# Altium schematic sheet inverter.SchDoc
size 431 x 279 mm; SheetNumber: 4; SheetTotal: 4
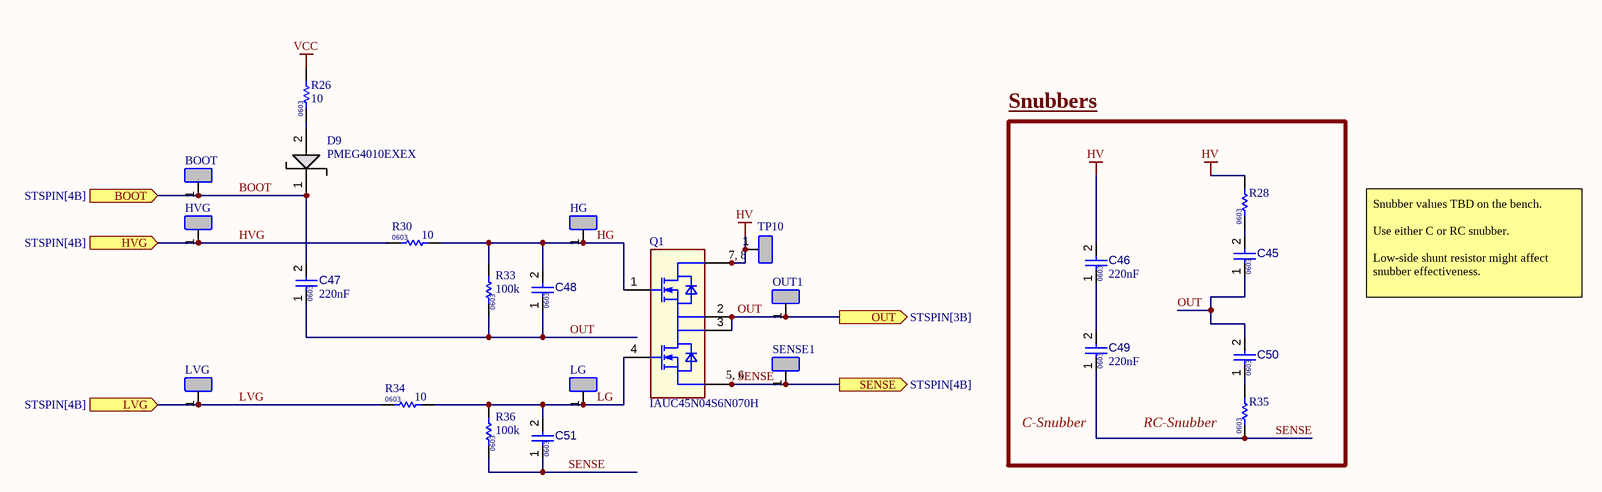
[diagram p0: inverter.SchDoc]

## Parts
BOOT  RCT-0C  [RCT-0C-Footprint-1]  (value not drawn)
C45  Ceramic Capacitor 0603 Temp  [0603 IPC Class B]  (value not drawn)
C46  value 220nF  [0603 IPC Class B]  (hidden comment: Ceramic Capacitor 0.22uF +/-10% 50V 0603)
C47  value 220nF  [0603 IPC Class B]  (hidden comment: Ceramic Capacitor 0.22uF +/-10% 50V 0603)
C48  Ceramic Capacitor 0603 Temp  [0603 IPC Class B]  (value not drawn)
C49  value 220nF  [0603 IPC Class B]  (hidden comment: Ceramic Capacitor 0.22uF +/-10% 50V 0603)
C50  Ceramic Capacitor 0603 Temp  [0603 IPC Class B]  (value not drawn)
C51  Ceramic Capacitor 0603 Temp  [0603 IPC Class B]  (value not drawn)
D9  PMEG4010EXEX  [PMEG4010EXEX]
HG  RCT-0C  [RCT-0C-Footprint-1]  (value not drawn)
HVG  RCT-0C  [RCT-0C-Footprint-1]  (value not drawn)
LG  RCT-0C  [RCT-0C-Footprint-1]  (value not drawn)
LVG  RCT-0C  [RCT-0C-Footprint-1]  (value not drawn)
OUT1  RCT-0C  [RCT-0C-Footprint-1]  (value not drawn)
Q1  IAUC45N04S6N070H  [IFX-PG-TDSON-8-57-V]
R26  value 10  [0603 IPC Class B]  (hidden comment: Resistor 10R +/-1% 250mW 0603)
R28  Resistor 0603 Temp  [0603 IPC Class B]  (value not drawn)
R30  value 10  [0603 IPC Class B]  (hidden comment: Resistor 10R +/-1% 250mW 0603)
R33  value 100k  [0603 IPC Class B]  (hidden comment: Resistor 100k +/-1% 1/10W 0603)
R34  value 10  [0603 IPC Class B]  (hidden comment: Resistor 10R +/-1% 250mW 0603)
R35  Resistor 0603 Temp  [0603 IPC Class B]  (value not drawn)
R36  value 100k  [0603 IPC Class B]  (hidden comment: Resistor 100k +/-1% 1/10W 0603)
SENSE1  RCT-0C  [RCT-0C-Footprint-1]  (value not drawn)
TP10  RCT-0C  [RCT-0C-Footprint-1]  (value not drawn)

## Blocks framed on the sheet
Snubbers: C45 C46 C49 C50 R28 R35

## Ports
BOOT (in, see STSPIN[4B]), HVG (in, see STSPIN[4B]), LVG (in, see STSPIN[4B]), OUT (out, see STSPIN[3B]), SENSE (out, see STSPIN[4B])

## Nets
HV: C46.2 Q1.7(DRAIN1_1) Q1.8(DRAIN1_2) R28.2 TP10.1(SIGNAL)
VCC: R26.2
BOOT: BOOT.1(SIGNAL) C47.2 D9.1(K) ; port BOOT
HG: C48.2 HG.1(SIGNAL) Q1.1(GATE1) R30.2 R33.2
HVG: HVG.1(SIGNAL) R30.1 ; port HVG
LG: C51.2 LG.1(SIGNAL) Q1.4(GATE2) R34.2 R36.2
LVG: LVG.1(SIGNAL) R34.1 ; port LVG
OUT: C45.1 C47.1 C48.1 C50.2 OUT1.1(SIGNAL) Q1.2(SOURCE1) Q1.3(DRAIN2) R33.1 ; port OUT
SENSE: C49.1 C51.1 Q1.5(SOURCE2_1) Q1.6(SOURCE2_2) R35.1 R36.1 SENSE1.1(SIGNAL) ; port SENSE
NetC45_2: C45.2 R28.1
NetC46_1: C46.1 C49.2
NetC50_1: C50.1 R35.2
NetD9_2: D9.2(A) R26.1

## Notes on the sheet
- Snubber values TBD on the bench.
  Use either C or RC snubber.
  Low-side shunt resistor might affect snubber effectiveness.
- C-Snubber
- (near R35) RC-Snubber
- DWG. NO.
- REV.
- SHT.
- THIS DOCUMENT AND THE DATA DISCLOSED HEREIN OR HEREWITH IS THE PROPERTY OF ALTIUM LIMITED AND MAY BE FREELY DISTRIBUTED IN WHOLE. NO RIGHTS ARE RESERVED OR EXPRESS OR IMPLIED WARANTEE GIVEN.
- REVISION
- DESCRIPTION
- DATE
- APPROVED
- ENG:
- APPROVALS
- PROJECT
- DSN:
- CHK:
- REFERENCE DOCUMENTS
- PROJECT REVISION:
- TITLE
- DOCUMENT REVISION:
- DESIGN ITEM:
- BOM:
- FAB DWG:
- PCB DWG:
- ASSY DWG:
- SCALE:
- SIZE
- B
- CAGE CODE
- FILE NAME
- DWG NO.
- SHEET
- OF
- REV
- (in symbol IAUC45N04S6N070H) 7, 8; 5, 6

## Library data of the parts
BOOT HG HVG LG LVG OUT1 SENSE1 TP10 = CMP-024-000003-4: Metal Foil, 0W, 0.05ohm, Surface Mount, 0805; Manufacturer Part Number 1: RCT-0C
C45 C48 C50 C51 = CMP-001-00218-3: Template for 0603 ceramic capacitor; Pins: 2; Mounting Technology: SM; Case/Package: 0603; Capacitor Type: Ceramic
C46 C47 C49 = CMP-001-00222-1: Ceramic Capacitor, Multilayer, Ceramic, 50V, 10% +Tol, 10% -Tol, X7R, 15% TC, 0.22uF, Surface Mount, 0603; RoHS Compliant: Yes; Min Operating Temperature: -55°C; Case/Package: 0603; Mounting Technology: Surface Mount; Pins: 2; Max Operating Temperature: 125°C; Capacitor Type: Ceramic
D9 = CMP-004-00061-3: PMEG4010EXE-Q - 40 V; Manufacturer_Name: Nexperia; Manufacturer_Part_Number: PMEG4010EXEX; Datasheet Link: https://assets.nexperia.com/documents/data-sheet/PMEG4010EXE.pdf; Height: 1mm; Design Item ID: PMEG4010EXEX; Source: SamacSys.SchLib
Q1 = IAUC45N04S6N070H: MOSFET 2N-CH 40V 45A 8TDSON; Manufacturer: Infineon Technologies; PackageReference: PG-TDSON-8-57; Manufacturer Order Number: IAUC45N04S6N070H
R26 R30 R34 = CMP-009-00398-1: SMD Chip Resistor, 10 Ohm, ± 1%, 250 mW, 0603 [1608 Metric], Thick Film, Anti-Surge; Power: 250mW; Pins: 2; Case/Package: 0603
R28 R35 = CMP-009-00391-3: Template for 0603 Resistor; Case/Package: 0603; Pins: 2
R33 R36 = CMP-009-00395-2: Fixed Resistor, Metal Glaze/thick Film, 0.1W, 100000ohm, 75V, 1% +/-Tol, 100ppm/Cel, Surface Mount, 0603; Power: 100mW; Tolerance: 1%; Case/Package: 0603; Max Operating Temperature: 155°C; Pins: 2; Min Operating Temperature: -55°C; Mounting Technology: Surface Mount; RoHS Compliant: Yes